# EAGLE design OpenSprinkler_v14 (EAGLE 5.12)
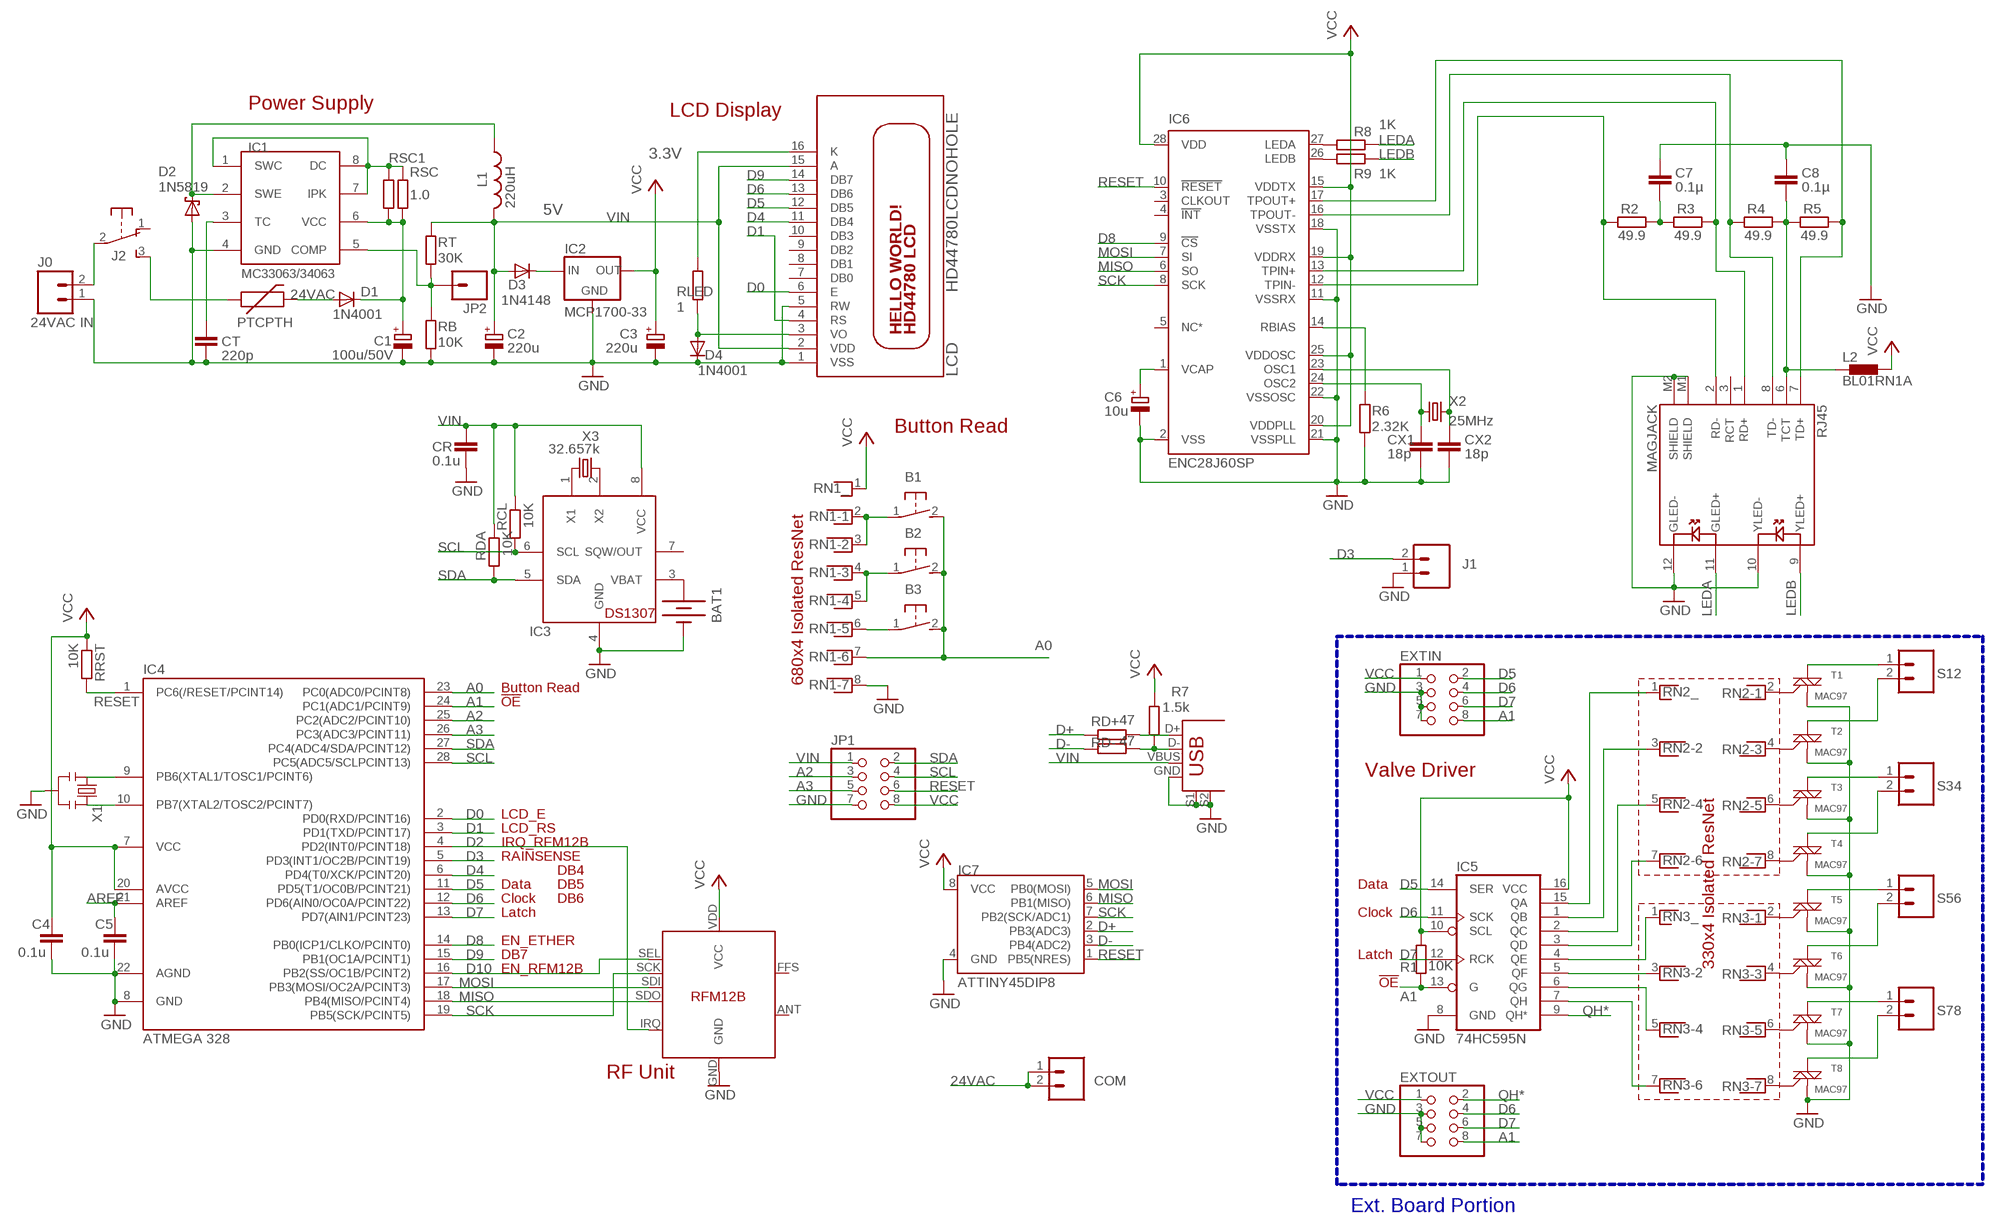
[diagram p0: schematic, sheet 1]

## Parts
B1  31-XX  [B3F-31XX]
B2  31-XX  [B3F-31XX]
B3  31-XX  [B3F-31XX]
BAT1  BATTERY12PTH  [BATTCON_12MM_PTH]
C1  100u/50V  CPOL-EUE3.5-8  [E3,5-8]
C2  220u  CPOL-EUE2-5  [E2-5]
C3  220u  CPOL-EUE2-5  [E2-5]
C4  0.1u  C-EU025-024X044  [C025-024X044]
C5  0.1u  C-EU025-024X044  [C025-024X044]
C6  10u  CPOL-EUE1.8-4  [E1,8-4]
C7  0.1µ  C-EU025-024X044  [C025-024X044]
C8  0.1µ  C-EU025-024X044  [C025-024X044]
COM  M025MM  [SCREWTERMINAL-5MM-2]
CR  0.1u  C-EU025-024X044  [C025-024X044]
CT  220p  C-EU025-024X044  [C025-024X044]
CX1  18p  C-EU025-024X044  [C025-024X044]
CX2  18p  C-EU025-024X044  [C025-024X044]
D1  1N4001  DIODE-DO41-7.6  [DO41-7.6]
D2  1N5819  1N5817-B  [DO41-7.6]
D3  1N4148  1N4148DO35-7  [DO35-7]
D4  1N4001  DIODE-DO41-7.6  [DO41-7.6]
EXTIN  PINHD-2X4  [2X04]
EXTOUT  PINHD-2X4  [2X04]
IC1  MC33063/MC34063P  [DIL08]
IC2  MCP1700-33  MCP1700INLINE  [TO92-INLINE]
IC3  DS1307  [DIL08]
IC4  ATMEGA 328  ATMEGA48/88/168-PU  [DIL28-3]
IC5  74HC595N  74LS595N  [DIL16]
IC6  ENC28J60SP  [DIL28-3]
IC7  ATTINY45DIP8  [DIP08]
IC8  RFM12B  [RFM12B]
J0  24VAC IN  M025MM  [SCREWTERMINAL-5MM-2]
J1  M025MM  [SCREWTERMINAL-5MM-2]
J2  EG1206  [EG1206]
JP1  PINHD-2X4  [2X04]
JP2  M01PTH  [1X01]
L1  220uH  L-US6000-XXX-RC  [6000-XXXX-RC]
L2  BL01RN1A  [BL01RN1A]
LCD  HD44780LCDNOHOLE  [LCD1602A]
PTC  PTCPTH  [PTC]
R1  10K  R-EU_0204/7  [0204/7]
R2  49.9  R-EU_0204/7  [0204/7]
R3  49.9  R-EU_0204/7  [0204/7]
R4  49.9  R-EU_0204/7  [0204/7]
R5  49.9  R-EU_0204/7  [0204/7]
R6  2.32K  R-EU_0204/7  [0204/7]
R7  1.5k  R-EU_0204/7  [0204/7]
R8  1K  R-EU_0204/7  [0204/7]
R9  1K  R-EU_0204/7  [0204/7]
RB  10K  R-EU_0204/7  [0204/7]
RCL  10K  R-EU_0204/7  [0204/7]
RD+  47  R-EU_0204/7  [0204/7]
RD-  47  R-EU_0204/7  [0204/7]
RDA  10K  R-EU_0204/7  [0204/7]
RJ45  MAGJACK  [MAGJACK]
RLED  1  R-EU_0204/7  [0204/7]
RN1  RNX7  [RN-8]
RN2  RNX7  [RN-8]
RN3  RNX7  [RN-8]
RRST  10K  R-EU_0204/7  [0204/7]
RSC  1.0  R-EU_0204/2V  [0204V]
RSC1  1.0  R-EU_0204/2V  [0204V]
RT  30K  R-EU_0204/7  [0204/7]
S12  M025MM  [SCREWTERMINAL-5MM-2]
S34  M025MM  [SCREWTERMINAL-5MM-2]
S56  M025MM  [SCREWTERMINAL-5MM-2]
S78  M025MM  [SCREWTERMINAL-5MM-2]
T1  MAC97  LX807DE  [TO-92]
T2  MAC97  LX807DE  [TO-92]
T3  MAC97  LX807DE  [TO-92]
T4  MAC97  LX807DE  [TO-92]
T5  MAC97  LX807DE  [TO-92]
T6  MAC97  LX807DE  [TO-92]
T7  MAC97  LX807DE  [TO-92]
T8  MAC97  LX807DE  [TO-92]
USB  USB+SHIELD  [USB-B-PTH]
X1  RESONATORPTH  [RESONATOR-PTH]
X2  25MHz  CRYSTALHC49US  [HC49US]
X3  32.657k  CRYSTALTC26H  [TC26H]

## Nets
24VAC [power]: COM.1 COM.2 D1.A PTC.P$2
A0: B1.2(S) B2.2(S) B3.2(S) IC4.23(PC0(ADC0/PCINT8)) RN1.7
A1: EXTIN.8 EXTOUT.8 IC4.24(PC1(ADC1/PCINT9)) IC5.13(G) R1.1
A2: IC4.25(PC2(ADC2/PCINT10)) JP1.3
A3: IC4.26(PC3(ADC3/PCINT11)) JP1.5
AREF: C5.1 IC4.21(AREF)
D0: IC4.2(PD0(RXD/PCINT16)) LCD.6(E)
D1: IC4.3(PD1(TXD/PCINT17)) LCD.4(RS)
D2: IC4.4(PD2(INT0/PCINT18)) IC8.IRQ
D3: IC4.5(PD3(INT1/OC2B/PCINT19)) J1.2
D4: IC4.6(PD4(T0/XCK/PCINT20)) LCD.11(DB4)
D5: EXTIN.2 IC4.11(PD5(T1/OC0B/PCINT21)) IC5.14(SER) LCD.12(DB5)
D6: EXTIN.4 EXTOUT.4 IC4.12(PD6(AIN0/OC0A/PCINT22)) IC5.11(SCK) LCD.13(DB6)
D7: EXTIN.6 EXTOUT.6 IC4.13(PD7(AIN1/PCINT23)) IC5.12(RCK)
D8: IC4.14(PB0(ICP1/CLKO/PCINT0)) IC6.9(!CS)
D9: IC4.15(PB1(OC1A/PCINT1)) LCD.14(DB7)
D10: IC4.16(PB2(SS/OC1B/PCINT2)) IC8.SEL
D+: IC7.2(PB3(ADC3)) RD+.1
D-: IC7.3(PB4(ADC2)) RD-.1
GND [power]: BAT1.GND(-) C1.- C2.- C3.- C4.2 C5.2 C6.- C7.1 C8.1 CR.2 CT.2 CX1.2 CX2.2 D2.A D4.C EXTIN.3 EXTIN.5 EXTIN.7 EXTOUT.3 EXTOUT.5 EXTOUT.7 IC1.4(GND) IC2.1(GND) IC3.4(GND) IC4.8(GND) IC4.22(AGND) IC5.8(GND) IC6.2(VSS) IC6.11(VSSRX) IC6.18(VSSTX) IC6.21(VSSPLL) IC6.22(VSSOSC) IC7.4(GND) IC8.GND J0.1 J1.1 JP1.7 LCD.1(VSS) LCD.5(RW) R6.2 RB.2 RJ45.10(YLED-) RJ45.12(GLED-) RJ45.M1(SHIELD) RJ45.M2(SHIELD) RN1.8 T1.1(M1) T2.1(M1) T3.1(M1) T4.1(M1) T5.1(M1) T6.1(M1) T7.1(M1) T8.1(M1) USB.GND USB.S1 USB.S2 X1.2
LEDA: R8.2 RJ45.11(GLED+)
LEDB: R9.2 RJ45.9(YLED+)
MISO: IC4.18(PB4(MISO/PCINT4)) IC6.6(SO) IC7.6(PB1(MISO)) IC8.SDO
MOSI: IC4.17(PB3(MOSI/OC2A/PCINT3)) IC6.7(SI) IC7.5(PB0(MOSI)) IC8.SDI
N$2: IC4.9(PB6(XTAL1/TOSC1/PCINT6)) X1.1
N$3: RN2.2 T1.2(G)
N$4: IC5.5(QF) RN3.3
N$5: IC5.6(QG) RN3.5
N$6 [power]: J0.2 J2.2(P)
N$7: IC5.7(QH) RN3.7
N$8: IC4.10(PB7(XTAL2/TOSC2/PCINT7)) X1.3
N$9 [power]: C1.+ D1.C IC1.6(VCC) RSC1.2 RSC.2
N$10: IC5.4(QE) RN3.1
N$11: IC5.3(QD) RN2.7
N$12: IC5.2(QC) RN2.5
N$13: IC5.1(QB) RN2.3
N$14: IC5.15(QA) RN2.1
N$15: RN2.4 T2.2(G)
N$16 [power]: S12.1 T1.3(M2)
N$17 [power]: S12.2 T2.3(M2)
N$18 [power]: S34.1 T3.3(M2)
N$19: RN2.6 T3.2(G)
N$20 [power]: S34.2 T4.3(M2)
N$21: RN2.8 T4.2(G)
N$22 [power]: S56.1 T5.3(M2)
N$23 [power]: S56.2 T6.3(M2)
N$24 [power]: S78.1 T7.3(M2)
N$25 [power]: S78.2 T8.3(M2)
N$26: RN3.2 T5.2(G)
N$27: RN3.4 T6.2(G)
N$28: RN3.6 T7.2(G)
N$29: RN3.8 T8.2(G)
N$30: C8.2 L2.1 R4.2 R5.1 RJ45.6(TCT)
N$31 [power]: J2.3(S) PTC.P$1
N$32: B1.1(P) RN1.2 RN1.3
N$33: B3.1(P) RN1.6
N$34: D3.C IC2.2(IN)
N$35: B2.1(P) RN1.4 RN1.5
N$36: BAT1.VCC@1(+) IC3.3(VBAT)
N$37: IC6.27(LEDA) R8.1
N$38: RD+.2 USB.D+
N$39: IC6.26(LEDB) R9.1
N$40 [power]: IC1.1(SWC) IC1.7(IPK) IC1.8(DC) RSC1.1 RSC.1
N$41: IC6.17(TPOUT+) R5.2 RJ45.7(TD+)
N$42: IC6.16(TPOUT-) R4.1 RJ45.8(TD-)
N$43: IC6.13(TPIN+) R3.2 RJ45.1(RD+)
N$44: IC6.12(TPIN-) R2.1 RJ45.2(RD-)
N$45: R7.1 RD-.2 USB.D-
N$46 [power]: D2.C IC1.2(SWE) L1.1
N$47: IC3.2(X2) X3.2
N$48: D4.A LCD.3(VO) RLED.2
N$49: CT.1 IC1.3(TC)
N$50: C6.+ IC6.1(VCAP)
N$51: IC6.14(RBIAS) R6.1
N$52: CX1.1 IC6.24(OSC2) X2.1
N$53: CX2.1 IC6.23(OSC1) X2.2
N$54: C7.2 R2.2 R3.1
N$55: IC1.5(COMP) JP2.1 RB.1 RT.2
N$56: LCD.16(K) RLED.1
N$57: IC3.1(X1) X3.1
QH*: EXTOUT.2 IC5.9(QH*)
RESET: IC4.1(PC6(/RESET/PCINT14)) IC6.10(!RESET) IC7.1(PB5(NRES)) JP1.6 RRST.2
SCK: IC4.19(PB5(SCK/PCINT5)) IC6.8(SCK) IC7.7(PB2(SCK/ADC1)) IC8.SCK
SCL: IC3.6(SCL) IC4.28(PC5(ADC5/SCLPCINT13)) JP1.4 RCL.2
SDA: IC3.5(SDA) IC4.27(PC4(ADC4/SDA/PCINT12)) JP1.2 RDA.2
VCC: C3.+ C4.1 EXTIN.1 EXTOUT.1 IC2.3(OUT) IC4.7(VCC) IC4.20(AVCC) IC5.10(SCL) IC5.16(VCC) IC6.15(VDDTX) IC6.19(VDDRX) IC6.20(VDDPLL) IC6.25(VDDOSC) IC6.28(VDD) IC7.8(VCC) IC8.VDD(VCC) JP1.8 L2.2 R1.2 R7.2 RN1.1 RRST.1
VIN: C2.+ CR.1 D3.A IC3.8(VCC) JP1.1 L1.2 LCD.2(VDD) LCD.15(A) RCL.1 RDA.1 RT.1 USB.VBUS
Unconnected: IC3.7(SQW/OUT) IC6.3(CLKOUT) IC6.4(!INT) IC6.5(NC*) IC8.ANT IC8.FFS J2.1(O) LCD.7(DB0) LCD.8(DB1) LCD.9(DB2) LCD.10(DB3) RJ45.3(RCT)

## Buses
B$1

## Notes on the sheet
- Power Supply
- LCD Display
- 3.3V
- 5V
- Button Read
- 680x4 Isolated ResNet
- Button Read
- !OE
- Valve Driver
- 330x4 Isolated ResNet
- LCD_E
- LCD_RS
- IRQ_RFM12B
- RAINSENSE
- DB4
- Data | DB5 | Data
- Clock | DB6
- Latch | Clock
- EN_ETHER
- DB7 | Latch
- EN_RFM12B
- !OE
- RF Unit
- Ext. Board Portion

## Library data of the parts
B1-B3 = adafruit:31-XX: OMRON SWITCH Now with beefier pads!
BAT1 = SparkFun:BATTERY: Battery Holders Various common sizes : AA, AAA, 20mm coin cell and 12mm coin cell.
C1-C3 C6 = resistor:CPOL-EU: POLARIZED CAPACITOR, European symbol
C4 C5 CR CT = rcl:C-EU: CAPACITOR, European symbol
C7 C8 CX1 CX2 = resistor:C-EU: CAPACITOR, European symbol
COM J0 J1 S12 S34 S56 S78 = SparkFun:M02: Header 2 Standard 2-pin 0.1" header. Use with straight break away headers (SKU : PRT-00116), right angle break away headers (PRT-00553), swiss pins (PRT-00743), machine pins (PRT-00117), and female headers (PRT-00115). Molex polarized connector foot print use with SKU : PRT-08233 with associated crimp pins and housings.
D1 D4 = diode:DIODE-: DIODE
D2 = diode:1N581*: 1.0A SCHOTTKY BARRIER RECTIFIER Source: http://www.diodes.com/datasheets/ds23001.pdf
D3 = diode:1N4148: DIODE high speed (Philips)
EXTIN EXTOUT JP1 = pinhead:PINHD-2X4: PIN HEADER
IC1 = adafruit:MC33063/MC34063: MC33063 and MC34063 Basic DC/DC converter with internal power-NPN transistor, 100KHz, 1.5A peak switch current. 3-40 input/output.
IC2 = adafruit:MCP1700: VOLTAGE REGULATOR
IC3 = adafruit:DS1307: DS1307 Real time clock (RTC) with battery backup ability. Talk to it via i2c
IC4 = atmega8:ATMEGA48/88/168-PU
IC5 = SparkFun:74*595: 8-bit SHIFT REGISTER, output latch
IC6 = microchip:ENC28J60: Stand-Alone Ethernet Controller with SPI Interface Source: http://ww1.microchip.com/downloads/en/DeviceDoc/39662c.pdf; MF: MICROCHIP; MPN: ENC28J60/SP; OC_FARNELL: 1084619; OC_NEWARK: 96K3661
IC7 = SparkFun:ATTINY45: Atmel ATTiny45
IC8 = JeeLabs:RFM12B
J2 = adafruit:EG1206
JP2 = SparkFun:M01: Header 1 Standard 1-pin 0.1" header. Use with straight break away headers (SKU : PRT-00116), right angle break away headers (PRT-00553), swiss pins (PRT-00743), machine pins (PRT-00117), and female headers (PRT-00115).
L1 = rcl:L-US: INDUCTOR, American symbol
L2 = inductors:BL0: Noise Suppression Products/EMI Suppression Filters, Lead EMIFIL(R) Inductor Type Source: http://www.murata.com .. BL01RN1_DS.pdf
LCD = adafruit:HD44780LCD: HD44780 LCD Standard character type LCDs, available in sizes from 8x1 to 40x4!
PTC = SparkFunNew:PTC: Resettable Fuse PTC Resettable Fuse. Spark Fun Electronics SKU : COM-08357
R1-R9 RB RCL RD+ RD- RDA RLED RRST RSC RSC1 RT = rcl:R-EU_: RESISTOR, European symbol
RJ45 = SparkFunNew:MAGJACK
RN1-RN3 = resistor-net:RNX7: RESISTOR NETWORK; OC_FARNELL: unknown; OC_NEWARK: unknown
T1-T8 = SparkFun:LX807DE: LX807DE Triac http://www.littelfuse.com/data/en/Data_Sheets/Littelfuse_Triac_LX8.pdf
USB = SparkFunNew:USB+SHIELD: USB+Shield USB connector with shield pins connectable
X1 = SparkFun:RESONATOR: Resonator Small SMD resonator. This is the itty bitty 10/20MHz resonators with built in caps. CSTCE10M0G55 and CSTCE20M0V53. Footprint has been reviewed closely but hasn't been tested yet.
X2 = SparkFun:CRYSTAL: Crystals Various standard crystals. Proven footprints. Spark Fun Electronics SKU : COM-00534
X3 = crystal:CRYSTAL: CRYSTAL; OC_FARNELL: unknown; OC_NEWARK: unknown

## Net classes
0 default: width 0.305 mm, clearance 0.203 mm
1 power: width 0.813 mm, clearance 0.203 mm

## Board
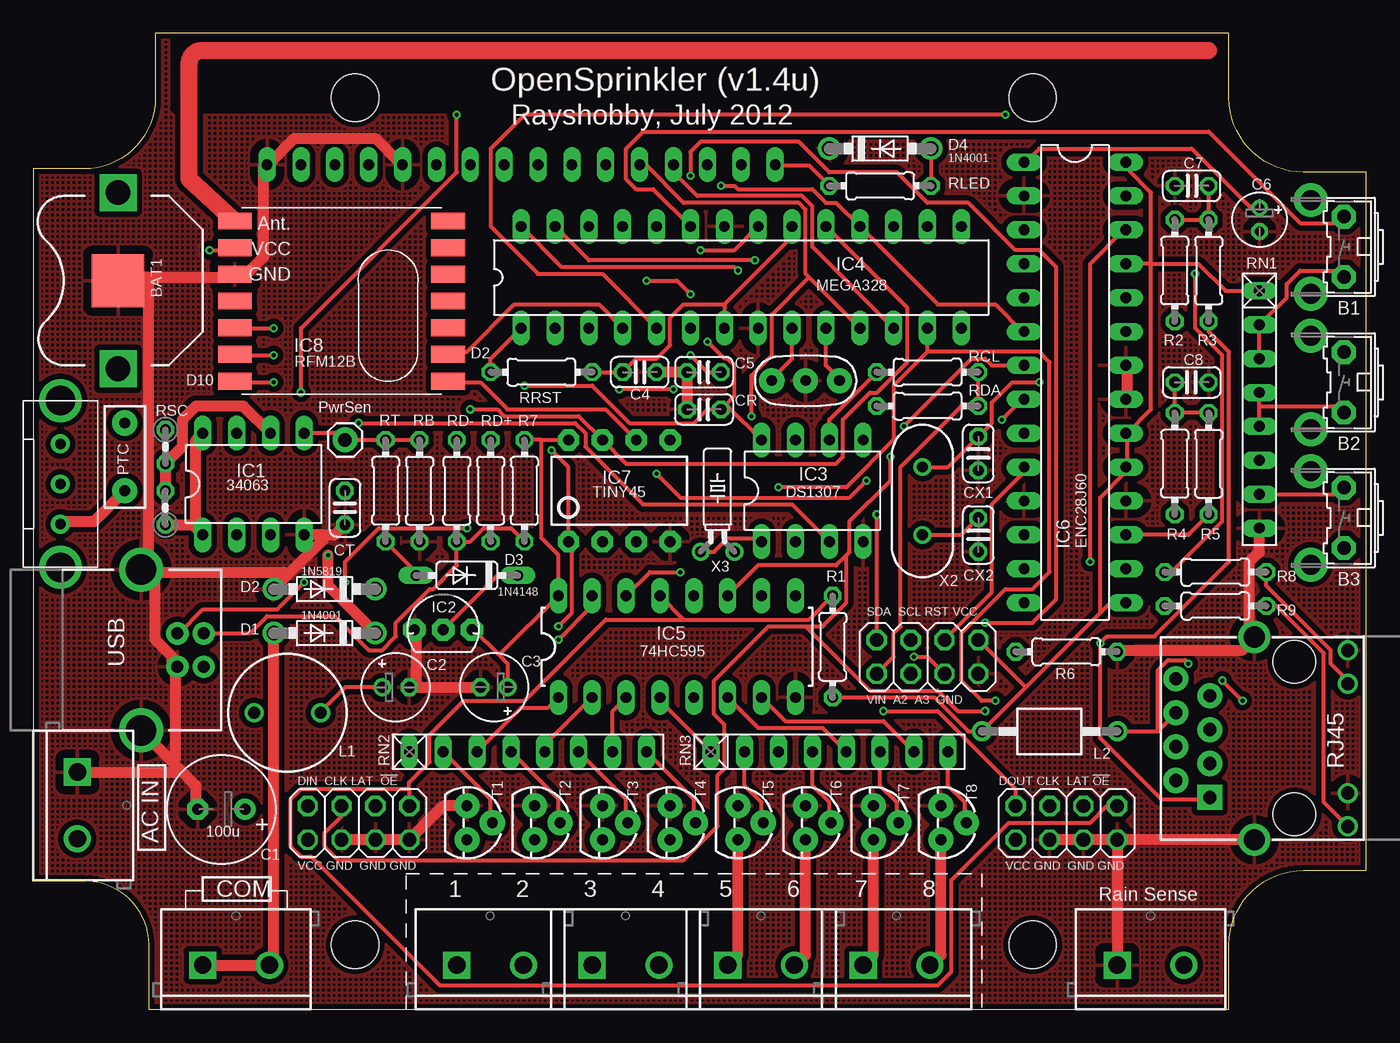
[diagram p1: board, top side]
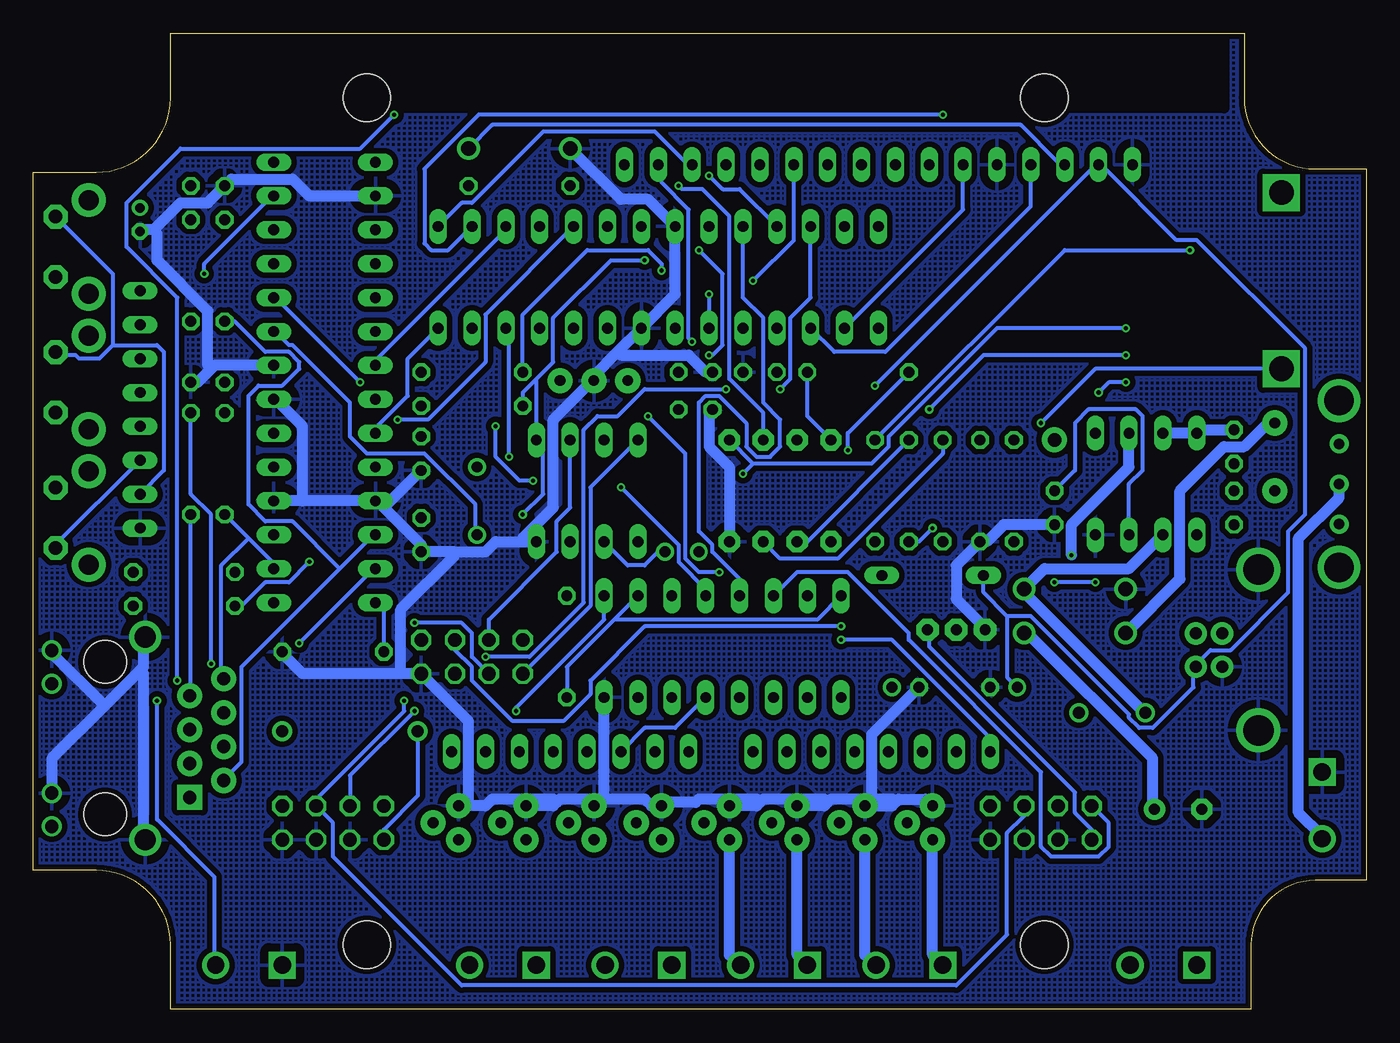
[diagram p2: board, bottom side, seen from below]

Size 99.95 x 73.15 mm. Coordinates in mm from the lower left corner, seen from the top.
Outline: 8.64,0 89.66,0 89.66,4.83 arc-90 95.25,10.41 99.95,10.41 99.95,62.74 95.25,62.74 arc-90 89.66,68.33 89.66,73.15 9.14,73.15 9.14,68.33 arc-90 3.81,62.99 0,62.99 0,9.65 3.81,9.65 arc-90 8.64,4.83 8.64,0
Copper layers (1*16): Top 0.035mm / dielectric 1.5mm / Bottom 0.035mm
Design rules "Fusion_eagle_rule_v1.1 *": minimum track width 6mil, minimum drill 12mil, track to track 6mil, track to pad 6mil, pad to pad 8mil, via to via 8mil, smd to smd 0mil, copper to edge 10mil, drill to drill 10mil, minimum pad ring 10mil, minimum via ring 6mil, stop-mask expansion 2mil, vias tented up to drill 100mil, thermal gap 25mil
Holes 3.56 mm at 24.13,4.83 74.93,4.83 24.13,68.33 74.93,68.33
tRestrict: area 10.7,67.6 to 89.2,72.6
bRestrict: area 10.7,67.6 to 89.2,72.6
vRestrict: area 21.6,2.3 to 26.7,7.4; area 72.4,2.3 to 77.5,7.4; area 64.8,33 to 68.6,43.2; area 25.9,43.7 to 29.7,44.5; area 31,43.7 to 37.6,44.5; area 72.9,10.4 to 82.3,10.9; area 72.4,16.8 to 81.8,17.3; area 19.8,16.8 to 29,17.3; area 19.8,10.4 to 29,10.9; area 35.3,22.1 to 35.8,22.6; area 25.9,25.7 to 26.4,26.2; area 16.8,13.5 to 17.5,14.2; 5 more areas

### Footprints (pad centres in the part's own frame; a part is rotated, then mirrored left to right if it is on the bottom)
B3F-31XX = drill 1.016 pad 1.778 octagon: 1 -2.261,-1.245; 2 2.261,-1.245 | drill 1.499 pad 2.54 round: 3 -3.505,1.245; 4 3.505,1.245
BATTCON_12MM_PTH = smd 3.962 x 3.962: GND 0,0 | drill 1.854 square: VCC@1 -6.604,0; VCC@2 6.604,0
E3,5-8 = drill 0.813 pad 1.6 round: + -1.778,0 | drill 0.813 pad 1.6 octagon: - 1.778,0
E2-5 = drill 0.813 pad 1.27 round: + -1.016,0 | drill 0.813 pad 1.27 octagon: - 1.016,0
C025-024X044 = drill 0.813 octagon: 1 -1.27,0; 2 1.27,0
E1,8-4 = drill 0.711 pad 1.168 round: + -0.889,0 | drill 0.711 pad 1.168 octagon: - 0.889,0
SCREWTERMINAL-5MM-2 = drill 1.3 pad 2.032 square: 1 0,0 | drill 1.3 pad 2.032 round: 2 5,0
DO41-7.6 = drill 1.1 pad 1.7 round: A 3.81,0; C -3.81,0
DO35-7 = drill 0.813 long: A 3.81,0; C -3.81,0
2X04 = drill 1.016 octagon: 1 -3.81,-1.27; 2 -3.81,1.27; 3 -1.27,-1.27; 4 -1.27,1.27; 5 1.27,-1.27; 6 1.27,1.27; 7 3.81,-1.27; 8 3.81,1.27
DIL08 = drill 0.813 long: 1 -3.81,-3.81; 2 -1.27,-3.81; 3 1.27,-3.81; 4 3.81,-3.81; 5 3.81,3.81; 6 1.27,3.81; 7 -1.27,3.81; 8 -3.81,3.81
TO92-INLINE = drill 0.813 pad 1.676 octagon: 1 -2.159,0; 2 0,0; 3 2.159,0
DIL28-3 = drill 0.813 long: 1 -16.51,-3.81; 2 -13.97,-3.81; 3 -11.43,-3.81; 4 -8.89,-3.81; 5 -6.35,-3.81; 6 -3.81,-3.81; 7 -1.27,-3.81; 8 1.27,-3.81; 9 3.81,-3.81; 10 6.35,-3.81; 11 8.89,-3.81; 12 11.43,-3.81; 13 13.97,-3.81; 14 16.51,-3.81; 15 16.51,3.81; 16 13.97,3.81; 17 11.43,3.81; 18 8.89,3.81; 19 6.35,3.81; 20 3.81,3.81; 21 1.27,3.81; 22 -1.27,3.81; 23 -3.81,3.81; 24 -6.35,3.81; 25 -8.89,3.81; 26 -11.43,3.81; 27 -13.97,3.81; 28 -16.51,3.81
DIL16 = drill 0.813 long: 1 -8.89,-3.81; 2 -6.35,-3.81; 3 -3.81,-3.81; 4 -1.27,-3.81; 5 1.27,-3.81; 6 3.81,-3.81; 7 6.35,-3.81; 8 8.89,-3.81; 9 8.89,3.81; 10 6.35,3.81; 11 3.81,3.81; 12 1.27,3.81; 13 -1.27,3.81; 14 -3.81,3.81; 15 -6.35,3.81; 16 -8.89,3.81
DIP08 = drill 0.813 pad 1.6 octagon: 1 -3.81,-3.81; 2 -1.27,-3.81; 3 1.27,-3.81; 4 3.81,-3.81; 5 3.81,3.81; 6 1.27,3.81; 7 -1.27,3.81; 8 -3.81,3.81
RFM12B = smd 2.54 x 1.27: ANT 8,-6; FFS -8,2; GND 8,-2; IRQ -8,4; P$8 -8,0; P$9 -8,-2; P$10 -8,-4; P$12 -8,-6; P$16 8,0; SCK 8,4; SDI 8,2; SDO -8,6; SEL 8,6; VDD 8,-4
EG1206 = drill 0.8 pad 1.422 round: 1 -3,0; 2 0,0; 3 3,0 | drill 2.2 round: MT1 -6.25,0; MT2 6.25,0
1X01 = drill 1.016 pad 1.88 round: 1 0,0
6000-XXXX-RC = drill 0.9 pad 1.422 round: 1 -2.5,0; 2 2.5,0
BL01RN1A = drill 0.9 pad 1.5 round: 1 -5.08,0; 2 5.08,0
LCD1602A = drill 0.8 long: 1 8,33.46; 2 10.54,33.46; 3 13.08,33.46; 4 15.62,33.46; 5 18.16,33.46; 6 20.7,33.46; 7 23.24,33.46; 8 25.78,33.46; 9 28.32,33.46; 10 30.86,33.46; 11 33.4,33.46; 12 35.94,33.46; 13 38.48,33.46; 14 41.02,33.46; 15 43.56,33.46; 16 46.1,33.46
PTC = drill 0.8 pad 1.88 round: P$1 -2.54,0; P$2 2.54,0
0204/7 = drill 0.813 octagon: 1 -3.81,0; 2 3.81,0
MAGJACK = drill 1 pad 1.88 square: 1 3.175,17.445 | drill 1 pad 1.88 round: 2 4.445,19.985; 3 5.715,17.445; 4 6.985,19.985; 5 8.255,17.445; 6 9.525,19.985; 7 10.795,17.445; 8 12.065,19.985 | drill 1 pad 1.27 round: 9 1,7.1; 10 3.5,7.1; 11 11.7,7.1; 12 14.2,7.1 | drill 1.6 pad 2.184 round: M1 0,14.1; M2 15.2,14.1 | hole 3.2: 1.905,11.095; 13.335,11.095
RN-8 = drill 0.813 long: 1 -8.89,0; 2 -6.35,0; 3 -3.81,0; 4 -1.27,0; 5 1.27,0; 6 3.81,0; 7 6.35,0; 8 8.89,0
0204V = drill 0.813 octagon: 1 -1.27,0; 2 1.27,0
TO-92 = drill 0.813 pad 1.88 round: 1 -1.27,0; 2 0,1.905; 3 1.27,0
USB-B-PTH = drill 0.914 pad 1.676 round: D+ 0,1.25; D- 1.981,1.25; GND 0,-1.25; VBUS 1.981,-1.25 | drill 2.286 round: S1 -2.718,-6.02; S2 -2.718,6.02
RESONATOR-PTH = drill 0.8 pad 1.88 round: 1 -2.54,0; 2 0,0; 3 2.54,0
HC49US = drill 0.813 round: 1 -2.54,0; 2 2.54,0
TC26H = drill 0.813 round: 1 -1.27,0; 2 1.27,0

### Placement (x,y rotation side)
B1  97.03,57.15 90 top
B2  97.03,46.99 90 top
B3  97.03,36.83 90 top
BAT1  6.35,54.61 90 top
C1  14.1,14.99 180 top
C2  27.18,24.13 0 top
C3  34.54,24.13 180 top
C4  45.47,47.75 0 top
C5  50.29,47.75 180 top
C6  91.95,59.18 270 top
C7  86.87,61.72 0 top
C8  86.87,46.99 180 top
COM  12.7,3.3 0 top
CR  50.29,44.96 180 top
CT  23.37,37.59 270 top
CX1  70.87,41.66 270 top
CX2  70.87,35.56 270 top
D1  21.84,28.19 180 top
D2  21.84,31.5 180 top
D3  32.51,32.51 180 top
D4  63.5,64.52 0 top
EXTIN  24.38,13.97 0 top
EXTOUT  77.47,13.97 0 top
IC1  16.51,39.37 0 top
IC2  30.73,28.45 0 top
IC3  58.42,38.86 0 top
IC4  53.09,54.86 0 top
IC5  48.26,27.18 0 top
IC6  78.11,46.99 270 top
IC7  43.94,38.86 0 top
IC8  23.11,53.09 180 top
J0  3.3,17.78 270 top
J1  81.28,3.3 0 top
J2  2.03,39.37 270 top
JP1  67.06,26.42 0 top
JP2  23.37,42.67 0 top
L1  19.05,22.23 0 top
L2  76.2,20.83 180 top
LCD  9.53,29.84 0 top
PTC  6.86,41.4 90 top
R1  59.94,27.18 270 top
R2  85.6,55.37 90 top
R3  88.14,55.37 270 top
R4  85.6,40.89 90 top
R5  88.14,40.89 270 top
R6  77.47,26.8 0 top
R7  36.83,38.86 90 top
R8  88.65,32.77 0 top
R9  88.65,30.23 0 top
RB  28.96,38.86 270 top
RCL  67.06,47.75 180 top
RD+  34.29,38.86 270 top
RD-  31.75,38.86 270 top
RDA  67.06,45.21 180 top
RJ45  105.66,12.7 90 top
RLED  63.5,61.72 0 top
RN1  91.95,44.96 270 top
RN2  37.08,19.3 0 top
RN3  59.69,19.3 0 top
RRST  38.1,47.75 180 top
RSC  9.91,42.16 270 top
RSC1  9.91,37.59 90 top
RT  26.42,38.86 90 top
S12  31.75,3.3 0 top
S34  41.91,3.3 0 top
S56  52.07,3.3 0 top
S78  62.23,3.3 0 top
T1  32.51,13.97 270 top
T2  37.59,13.97 270 top
T3  42.67,13.97 270 top
T4  47.75,13.97 270 top
T5  52.83,13.97 270 top
T6  57.91,13.97 270 top
T7  62.99,13.97 270 top
T8  68.07,13.97 270 top
USB  10.79,26.92 0 top
X1  57.91,47.12 0 top
X2  66.67,38.1 270 top
X3  51.31,34.29 0 top

### Tracks (layer width: path | path; a pad name or v marks a point on that pad's centre or on a via)
24VAC
  Top 0.813: D1.A 18.03,3.56 17.78,3.3 COM.2 COM.1
  Bottom 0.813: PTC.P$2 7.37,43.94 9.14,42.16 10.67,42.16 13.97,38.86 13.97,32.26 D1.A
A0
  Top 0.305: RN1.7 97.79,38.61 B3.2 | IC4.23 46.48,61.47 45.21,61.47 44.45,62.23 44.45,64.52 45.72,65.79 88.14,65.79 95,58.93 97.79,58.93 B1.2
  Bottom 0.305: 93.98,49.78 95,48.77 96.52,48.77 96.77,49.02 98.04,49.02 B2.2 | 93.98,49.78 93.98,55.12 B1.2 | RN1.7 90.17,40.39 90.17,49.28 90.68,49.78 93.98,49.78
A1
  Top 0.305: 48.77,29.21 IC5.13 | 48.77,29.21 58.17,29.21 R1.1 | 28.19,16.51 28.19,17.02 29.72,18.54 29.72,20.57 32.26,23.11 36.83,23.11 42.93,29.21 48.77,29.21 | 28.19,16.51 EXTIN.8 | EXTOUT.8 80.52,15.24 79.25,13.97 73.15,13.97 68.83,9.65 68.83,2.79 67.82,1.78 30.48,1.78 20.83,11.43 20.07,11.43 19.3,12.19 19.3,15.75 20.07,16.51 28.19,16.51
  Bottom 0.305: IC4.24 46.74,53.34 45.21,51.82 45.21,45.47 43.94,44.2 43.94,42.16 44.7,41.4 45.72,41.4 46.48,42.16 46.48,43.94 48.51,45.97 49.53,45.97 50.04,45.47 50.04,35.81 49.02,34.8 49.02,34.29 46.99,32.26 IC5.13
A2  (via drill 0.3)
  Top 0.305: v49.28,62.48 49.28,64.26 50.04,65.02 57.4,65.02 59.69,62.74 64.77,62.74 67.06,60.45 70.1,60.45 73.66,56.9 75.44,56.9 76.71,55.63 76.71,30.73 74.93,28.96 v71.37,28.96
  Bottom 0.305: IC4.25 46.99,61.47 48.26,61.47 v49.28,62.48 | v71.37,28.96 67.82,28.96 67.06,28.19 67.06,26.42 JP1.3
A3  (via drill 0.3)
  Top 0.305: v48.01,46.48 v43.94,46.48 | v66.04,26.42 67.06,26.42 JP1.5
  Bottom 0.305: IC4.26 41.66,53.34 43.18,51.82 43.18,47.24 v43.94,46.48 | v48.01,46.48 54.1,46.48 56.13,44.45 57.66,44.45 58.67,43.43 58.67,30.48 62.74,26.42 v66.04,26.42
AREF  (via drill 0.3)
  Top 0.305: C5.1 50.55,47.75 v49.28,49.02 | v50.04,56.9 52.58,56.9 IC4.21
  Bottom 0.305: v49.28,49.02 49.02,49.02 48.26,49.78 48.26,55.12 v50.04,56.9
D0
  Bottom 0.305: IC4.2 30.23,59.94 30.23,63.25 LCD.6
D1
  Bottom 0.305: IC4.3 39.88,49.28 36.07,49.28 25.15,60.2 25.15,63.25 LCD.4
D2
  Top 0.305: IC4.4 42.42,52.83 36.07,52.83 32.51,49.28 31.24,49.28 IC8.IRQ
D3  (via drill 0.3)
  Top 0.305: IC4.5 42.67,55.12 37.85,55.12 34.29,58.67 34.29,64.52 36.83,67.06 v72.9,67.06 | v90.68,23.11 v89.15,24.64
  Bottom 0.305: v72.9,67.06 75.44,64.52 88.9,64.52 92.96,60.45 92.96,57.15 89.15,53.34 v89.15,24.64 | v90.68,23.11 90.68,14.22 86.36,9.91 86.36,3.3 J1.2
D4  (via drill 0.3)
  Top 0.305: v45.97,54.61 48.26,54.61 v49.28,53.59
  Bottom 0.305: v45.97,54.61 42.93,57.66 42.93,63.25 LCD.11 | v49.28,53.59 IC4.6
D5  (via drill 0.3)
  Top 0.305: 58.17,54.86 IC4.11 | 58.17,54.86 57.91,55.12 57.91,59.94 57.4,60.45 48.77,60.45 45.97,63.25 45.47,63.25 LCD.12 | 58.17,54.86 55.37,52.07 55.37,49.02 53.85,47.5 v53.85,44.45 | v48.51,32.77 46.23,32.77 IC5.14
  Bottom 0.305: IC5.14 42.67,32.77 38.86,32.77 34.29,28.19 34.29,27.69 24.38,17.78 24.38,12.19 23.62,11.43 20.07,11.43 19.3,12.19 19.3,13.97 EXTIN.2 | v53.85,44.45 51.05,41.66 51.05,33.78 50.04,32.77 v48.51,32.77
D6  (via drill 0.3)
  Top 0.305: IC4.12 58.42,57.15 58.42,60.2 57.66,60.96 49.78,60.96 48.01,62.74 48.01,63.25 LCD.13 | IC5.11 54.36,33.27 60.2,33.27 60.96,34.04 | 60.96,34.04 61.21,34.29 61.21,36.58 64.26,39.62 v64.26,41.4 | EXTIN.4 23.11,14.48 21.84,13.21 21.84,12.19 22.86,11.18 48.77,11.18 51.31,13.72 51.31,17.53 51.82,18.03 51.82,21.34 51.05,22.1 51.05,24.64 55.12,28.7 57.91,28.7 | 57.91,28.7 59.18,28.7 60.96,30.48 60.96,34.04 | v71.37,22.35 69.34,22.35 67.82,23.88 62.74,23.88 57.91,28.7
  Bottom 0.305: v64.26,41.4 64.26,50.8 IC4.12 | EXTOUT.4 76.2,17.53 v71.37,22.35
D7  (via drill 0.3)
  Top 0.305: v55.88,39.12 60.96,39.12 64.52,42.67 64.52,46.74 67.06,49.28 | 67.06,49.28 IC4.13 | 67.06,49.28 75.44,49.28 76.2,48.51 76.2,32.77 74.93,31.5 72.9,31.5 69.6,28.19 69.6,24.64 71.12,23.11 v72.14,23.11
  Bottom 0.305: IC5.12 49.53,31.5 51.56,33.53 51.56,34.8 v55.88,39.12 | EXTIN.6 25.65,14.48 26.92,13.21 26.92,5.59 30.73,1.78 67.82,1.78 77.47,11.43 77.47,13.97 EXTOUT.6 78.74,15.75 72.14,22.35 v72.14,23.11
D8
  Bottom 0.305: IC4.14 71.88,48.77 71.88,45.97 74.17,43.69 74.17,43.18 IC6.9
D9
  Bottom 0.305: IC4.15 67.82,60.45 67.06,60.45 61.72,65.79 53.34,65.79 51.05,63.5 50.55,63.5 LCD.14
D10  (via drill 0.3)
  Top 0.305: v18.03,46.99 15.24,46.99 IC8.SEL | v20.07,46.23 20.07,51.05 31.75,62.74 v31.75,67.06
  Bottom 0.305: v18.03,46.99 19.3,46.99 v20.07,46.23 | v31.75,67.06 66.55,67.06 70.61,62.99 70.61,57.4 70.1,56.9 68.83,56.9 IC4.16
D+
  Bottom 0.305: RD+.1 41.91,35.05 IC7.2
D-
  Bottom 0.305: RD-.1 31.75,41.66 39.62,33.78 43.94,33.78 IC7.3
GND
  Top 0.813: 8.64,54.86 6.6,54.86 BAT1.GND | 8.64,54.86 14.99,54.86 IC8.GND 15.49,55.12 16,55.12 17.27,56.39 17.27,63.25 LCD.1 17.78,63.5 19.56,65.28 25.65,65.28 27.43,63.5 LCD.5 | 10.41,18.54 8.13,20.83 USB.S1 | 10.92,18.03 10.41,18.54 | 10.92,18.03 12.19,16.76 12.19,14.99 C1.- | 10.41,18.54 10.67,18.8 10.67,25.65 USB.GND 10.41,25.91 10.41,26.42 9.14,27.69 9.14,32.51 USB.S2 | J0.1 10.67,17.78 10.92,18.03 | 21.84,35.56 22.61,35.56 CT.2 | 21.84,35.56 IC1.4 | 19.05,32.51 21.84,35.31 21.84,35.56 | 19.05,32.51 D2.A | USB.S2 8.13,32.77 18.8,32.77 19.05,32.51 | 8.64,54.86 8.64,33.02 USB.S2 | C3.- C2.- 28.7,24.38 28.7,28.45 IC2.1 | EXTIN.3 EXTIN.5 EXTIN.7 30.73,15.24 T1.1 | EXTOUT.3 EXTOUT.5 EXTOUT.7 | EXTOUT.7 J1.1 | RJ45.M1 EXTOUT.7 | R6.2 81.28,26.92 90.68,26.92 91.44,27.69 RJ45.M2 91.19,27.94 91.19,33.53 91.95,34.29 RN1.8 | CR.2 C5.2 C4.2 | IC6.21 82.04,45.72 82.04,48.26 IC6.22
  Bottom 0.813: CT.2 27.18,36.32 28.45,35.05 RB.2 30.73,33.27 30.73,30.73 28.45,28.45 IC2.1 | 57.15,16 IC5.8 | 57.15,16 T6.1 57.91,15.75 60.45,15.75 60.71,15.49 | 57.15,16 56.9,15.75 54.1,15.75 53.59,15.24 T5.1 52.58,15.49 50.29,15.49 50.04,15.75 45.72,15.75 45.47,15.49 | T7.1 60.96,15.24 60.71,15.49 | 60.71,15.49 60.96,15.75 65.53,15.75 66.04,15.24 T8.1 67.31,15.49 67.31,21.59 JP1.7 72.39,25.15 | 35.31,15.49 35.05,15.75 33.02,15.75 T1.1 | 35.31,15.49 35.56,15.24 T2.1 37.08,16 37.08,20.57 C3.- | T3.1 40.64,15.24 40.39,15.49 | 40.39,15.49 40.13,15.75 35.56,15.75 35.31,15.49 | T4.1 45.72,15.24 45.47,15.49 | 45.47,15.49 45.21,15.75 40.64,15.75 40.39,15.49 | 91.95,25.4 91.69,25.65 91.69,27.69 RJ45.M2 | 91.95,25.4 94.61,22.73 | 94.61,22.73 98.55,18.8 98.55,16.26 RJ45.10 | RJ45.12 98.55,26.67 94.61,22.73 | 72.39,25.15 79.76,25.15 81.28,26.67 R6.2 | RJ45.M1 91.69,12.7 91.69,25.15 91.95,25.4 | IC7.4 47.75,40.64 49.28,42.16 49.28,44.7 CR.2 | 56.13,49.28 57.91,47.5 X1.2 58.17,46.99 60.96,44.2 60.96,37.59 63.25,35.31 63.25,35.05 | 56.13,49.28 IC4.8 51.82,53.59 IC4.22 53.85,60.71 55.88,60.71 D4.C | C5.2 49.53,47.75 50.8,49.02 55.88,49.02 56.13,49.28 | 90.93,58.42 91.95,58.42 C6.- | 90.93,58.42 88.9,60.45 86.87,60.45 C7.1 85.09,62.23 80.52,62.23 79.25,60.96 IC6.2 | C8.1 87.63,46.99 86.61,48.01 | 86.61,48.01 86.36,48.26 IC6.22 | IC6.11 74.17,38.1 70.87,34.8 CX2.2 68.33,34.29 | 63.25,35.05 65.28,35.05 66.04,34.29 68.33,34.29 | 63.25,35.05 IC3.4 | CX1.2 73.41,37.85 IC6.11 | 79.76,38.1 IC6.18 | IC6.11 79.76,38.1 | IC6.21 81.79,45.72 79.76,43.69 79.76,38.1 | 90.93,58.42 90.68,58.17 90.68,56.13 86.87,52.32 86.87,48.26 86.61,48.01
  Bottom 0.813: 72.39,25.15 72.39,29.97 68.33,34.04 68.33,34.29
  pour Top (isolate 0.406, hatched): 0,73.66 100.33,73.66 100.33,0 0,0
  pour Bottom (isolate 0.406, hatched): 0,73.66 100.33,73.66 100.33,0 0,0
LEDA
  Top 0.305: R8.2 92.46,31.75 97.28,26.92 97.28,25.91 98.55,24.64 RJ45.11
LEDB
  Top 0.305: R9.2 93.22,30.23 96.77,26.67 96.77,15.49 98.55,13.72 RJ45.9
MISO  (via drill 0.3)
  Top 0.305: IC7.6 42.93,44.96 35.56,44.96 33.53,46.99 31.24,46.99 IC8.SDO | IC6.6 74.17,50.8 72.14,52.83 67.82,52.83 IC4.18 60.2,60.45 59.44,60.45 58.42,61.47 52.83,61.47 52.58,61.72 v51.56,61.72
  Bottom 0.305: IC7.6 45.21,44.7 47.75,47.24 47.75,59.44 49.78,61.47 51.31,61.47 v51.56,61.72
MOSI  (via drill 0.3)
  Top 0.305: v18.03,51.05 15.24,51.05 IC8.SDI | v65.28,43.69 70.36,48.77 71.37,48.77 71.88,48.26 IC6.7 | v62.48,39.62 61.21,38.35 48.51,38.35 v46.74,40.13
  Bottom 0.305: IC4.17 64.52,58.42 74.17,48.77 74.17,48.26 IC6.7 | v18.03,51.05 27.69,51.05 35.81,42.93 35.81,42.16 37.08,40.89 45.97,40.89 | 45.97,40.89 IC7.5 | v65.28,43.69 65.28,41.4 63.5,39.62 v62.48,39.62 | 45.97,40.89 v46.74,40.13
N$1
  Top 1.27: 88.14,71.88 12.7,71.88 arc90 11.68,70.87 11.68,62.23 14.99,59.18
N$2
  Top 0.305: IC4.9 56.9,48.77 55.37,47.24 X1.1
N$3
  Top 0.305: RN2.2 34.29,15.75 34.29,13.97 T1.2
N$4
  Bottom 0.305: IC5.5 51.82,21.08 54.1,21.08 RN3.3
N$5
  Top 0.305: IC5.6 54.36,21.08 59.18,21.08 RN3.5
N$6
  Bottom 0.813: J2.2 2.03,38.35 5.08,35.31 5.08,14.73 3.3,12.95 J0.2
N$7
  Top 0.305: IC5.7 56.39,21.59 63.75,21.59 RN3.7
N$8
  Top 0.305: IC4.10 59.44,48.26 60.45,47.24 X1.3
N$9  (via drill 0.3)
  Top 0.813: RSC1.2 RSC.2 11.18,42.16 11.18,44.2 12.19,45.21 15.75,45.21 IC1.6 | v22.1,34.04 22.1,31.75 D1.C
  Bottom 0.813: D1.C 25.4,28.19 16,18.8 16,14.99 C1.+ | IC1.6 17.78,40.64 22.1,36.32 v22.1,34.04
N$10
  Top 0.305: RN3.1 46.99,23.11 IC5.4
N$11
  Top 0.305: RN2.7 43.43,22.35 IC5.3
N$12
  Top 0.305: RN2.5 38.35,19.81 IC5.2
N$13
  Top 0.305: RN2.3 36.58,22.61 38.61,22.61 IC5.1
N$14  (via drill 0.3)
  Top 0.305: v39.37,27.69 41.91,30.23 IC5.15
  Bottom 0.305: RN2.1 28.19,20.32 35.56,27.69 v39.37,27.69
N$15
  Top 0.305: RN2.4 39.37,15.75 39.37,13.97 T2.2
N$16
  Bottom 0.813: T1.3 32.51,4.06 S12.1
N$17
  Bottom 0.813: T2.3 37.59,4.06 36.83,3.3 S12.2
N$18
  Bottom 0.813: T3.3 42.67,4.06 S34.1
N$19
  Top 0.305: RN2.6 44.45,15.75 44.45,13.97 T3.2
N$20
  Bottom 0.813: T4.3 47.75,4.06 46.99,3.3 S34.2
N$21
  Top 0.305: RN2.8 49.53,15.75 49.53,13.97 T4.2
N$22
  Top 0.813: T5.3 52.83,4.06 S56.1
N$23
  Top 0.813: T6.3 57.91,4.06 57.15,3.3 S56.2
N$24
  Top 0.813: T7.3 62.99,4.06 S78.1
N$25
  Top 0.813: T8.3 68.07,4.06 67.31,3.3 S78.2
N$26
  Top 0.305: RN3.2 53.34,16.76 54.61,15.49 54.61,13.97 T5.2
N$27
  Top 0.305: RN3.4 58.42,16.76 59.69,15.49 59.69,13.97 T6.2
N$28
  Top 0.305: RN3.6 63.5,16.76 64.77,15.49 64.77,13.97 T7.2
N$29
  Top 0.305: RN3.8 68.58,16.76 69.85,15.49 69.85,13.97 T8.2
N$30  (via drill 0.3)
  Top 0.305: C8.2 R4.2 R5.1 | L2.1 84.33,20.83 | 84.33,20.83 85.6,22.1 RJ45.6 | v86.61,25.91 86.36,26.16 85.09,26.16 84.33,25.4 84.33,20.83
  Bottom 0.305: R5.1 88.14,38.61 86.61,37.08 v86.61,25.91
N$31
  Top 0.813: PTC.P$1 4.57,36.58 2.03,36.58 J2.3
N$32
  Top 0.305: RN1.3 RN1.2 93.98,53.34 93.98,54.36 95,55.37 97.79,55.37 B1.1
N$33
  Bottom 0.305: RN1.6 98.3,34.8 B3.1
N$34
  Top 0.305: D3.C 34.8,32.51 IC2.2
N$35
  Top 0.305: 91.95,45.21 RN1.4 | RN1.5 91.95,45.21 | 91.95,45.21 97.79,45.21 B2.1
N$36  (via drill 0.3)
  Top 0.305: IC3.3 56.9,37.85 45.72,37.85 41.4,42.16 41.4,43.18 40.64,43.94 v24.38,43.94
  Bottom 0.305: v24.38,43.94 20.32,48.01 BAT1.VCC@1
N$37  (via drill 0.3)
  Top 0.305: R8.1 85.34,32.77 89.15,36.58 89.15,49.02 87.12,51.05 v87.12,55.12
  Bottom 0.305: v87.12,55.12 87.12,55.88 82.04,60.96 IC6.27
N$38  (via drill 0.3)
  Top 0.305: v32.51,36.07 25.91,36.07 23.37,33.53 v23.37,32 | v20.32,32 18.29,29.97 12.7,29.97 10.92,28.19 USB.D+
  Bottom 0.305: RD+.2 33.53,35.05 v32.51,36.07 | v20.32,32 v23.37,32
N$39  (via drill 0.3)
  Top 0.305: v79.25,33.53 79.25,55.88 81.79,58.42 IC6.26
  Bottom 0.305: R9.1 84.33,30.23 82.55,32 80.77,32 v79.25,33.53
N$40
  Top 0.813: RSC1.1 11.94,36.32 IC1.1 12.19,36.58 12.19,42.67 IC1.8
  Bottom 0.813: RSC.1 12.45,43.43 IC1.8 IC1.7
N$41
  Top 0.305: R5.2 86.61,35.56 IC6.17
  Bottom 0.305: R5.2 88.14,23.62 RJ45.7
N$42
  Bottom 0.305: 83.82,35.31 R4.1 | 83.82,35.31 82.04,33.53 82.04,33.02 IC6.16 | 83.82,35.31 85.85,33.27 85.85,24.89 RJ45.8
N$43  (via drill 0.3)
  Top 0.305: RJ45.1 88.14,15.75 84.58,15.75 80.01,20.32 v80.01,27.43 80.52,27.94 84.07,27.94 89.66,33.53 89.66,49.28 88.14,50.8 R3.2
  Bottom 0.305: v80.01,27.43 74.42,33.02 IC6.13
N$44
  Bottom 0.305: 76.96,33.02 84.33,25.65 84.33,18.54 85.6,17.27 RJ45.2 | 76.96,33.02 74.42,35.56 IC6.12 | R2.1 84.84,51.56 82.55,49.28 80.77,49.28 80.01,48.51 80.01,48.01 81.28,46.74 83.06,46.74 83.82,45.97 83.82,37.85 82.55,36.58 80.52,36.58 76.96,33.02
N$45
  Top 0.305: R7.1 35.81,36.07 33.78,36.07 32.77,35.05 RD-.2 31.75,33.27 29.97,31.5 29.72,31.5 27.18,28.96 27.18,27.94 26.16,26.92 25.15,26.92 22.61,29.46 17.53,29.46 16.26,28.19 12.95,28.19 USB.D-
N$46
  Bottom 0.813: IC1.2 17.78,33.02 24.13,33.02 D2.C 25.65,31.24 16.76,22.35 L1.1
N$47
  Bottom 0.305: X3.2 53.09,34.29 54.1,33.27 55.37,33.27 IC3.2
N$48
  Top 0.305: D4.A RLED.2
  Bottom 0.305: D4.A 65.53,66.29 25.91,66.29 23.11,63.5 22.61,63.5 LCD.3
N$49
  Bottom 0.305: IC1.3 17.78,39.37 16.76,40.39 16.76,44.45 17.27,44.96 20.83,44.96 21.84,43.94 21.84,40.39 CT.1
N$50
  Top 0.305: C6.+ 91.95,60.2 91.19,60.2 86.87,64.52 75.44,64.52 74.42,63.5 IC6.1
N$51
  Bottom 0.305: R6.1 73.66,29.97 74.17,30.48 IC6.14
N$52  (via drill 0.3)
  Top 0.305: X2.1 68.58,40.64 CX1.1 71.88,43.94 71.88,45.47 73.41,46.99 v75.44,46.99
  Bottom 0.305: v75.44,46.99 81.79,53.34 IC6.24
N$53
  Top 0.305: CX2.1 69.6,35.56 X2.2
  Bottom 0.305: IC6.23 81.79,50.8 80.77,49.78 80.52,49.78 76.2,45.47 76.2,42.93 74.93,41.66 70.61,41.66 66.8,37.85 66.8,35.56 X2.2
N$54
  Top 0.305: R2.2 R3.1 C7.2
N$55
  Top 0.305: RB.1 RT.2 JP2.1 22.86,43.18 IC1.5
N$56
  Top 0.305: RLED.1 58.17,63.25 55.63,63.25 LCD.16
N$57
  Top 0.305: X3.1 51.05,34.29 52.07,35.31 54.36,35.31 IC3.1
QH*  (via drill 0.3)
  Top 0.305: v63.75,22.35 67.82,22.35 73.66,16.51 EXTOUT.2
  Bottom 0.305: IC5.9 57.15,29.21 63.75,22.61 v63.75,22.35
RESET  (via drill 0.3)
  Top 0.305: JP1.6 71.88,31.24 71.88,37.85 74.17,40.13 74.17,40.64 IC6.10 | RRST.2 34.29,48.77 IC4.1 | v38.86,41.91 40.13,40.64 IC7.1 40.39,34.8 40.39,29.72 v39.37,28.7
  Bottom 0.305: v38.86,41.91 38.86,43.18 RRST.2 | JP1.6 68.33,26.92 67.06,25.65 67.06,24.64 64.01,21.59 60.2,21.59 58.17,23.62 58.17,24.64 54.1,28.7 v39.37,28.7
SCK  (via drill 0.3)
  Top 0.305: v72.64,44.2 74.17,45.72 IC6.8 | v18.03,49.02 15.24,49.02 IC8.SCK | v32.77,44.96 34.8,44.96 35.31,44.45 40.89,44.45 IC7.7 44.45,40.89 60.2,40.89 60.71,41.4 60.71,44.2 62.74,46.23 63.25,46.23 65.53,48.51 65.53,52.58 IC4.19
  Bottom 0.305: IC4.19 66.04,52.07 66.04,48.51 70.36,44.2 v72.64,44.2 | v18.03,49.02 28.7,49.02 v32.77,44.96
SCL  (via drill 0.3)
  Top 0.305: IC4.28 39.62,55.63 52.58,55.63 v52.83,55.37 | IC3.6 59.69,44.2 RCL.2
  Bottom 0.305: v52.83,55.37 52.83,55.88 53.85,56.9 58.42,56.9 63.25,52.07 RCL.2 | JP1.4 65.79,29.21 60.71,34.29 60.71,36.58 59.69,37.59 IC3.6
SDA  (via drill 0.3)
  Top 0.305: IC4.27 41.66,56.13 v54.1,56.13 | JP1.2 v63.25,37.08
  Bottom 0.305: v54.1,56.13 56.64,56.13 60.96,51.82 60.96,48.51 62.23,47.24 | 62.23,47.24 63.25,46.23 RDA.2 | 62.23,47.24 IC3.5 61.72,42.16 61.72,38.61 v63.25,37.08
VCC  (via drill 0.3)
  Top 0.305: C3.+ 35.56,25.91 34.8,26.67 | 34.8,26.67 33.02,28.45 IC2.3 | 34.8,26.67 35.05,26.67 IC5.16 39.37,34.04 38.1,35.31 38.1,42.67 | 51.82,52.83 IC4.7 | 51.82,52.83 56.9,57.91 IC4.20 | RRST.1 C4.1 45.21,48.77 46.74,48.77 47.75,49.78 47.75,51.82 48.77,52.83 51.82,52.83 | v13.21,56.9 14.99,56.9 IC8.VDD | 38.1,42.67 R7.2 | 38.1,42.67 IC7.8 | RN1.1 89.41,53.85 87.38,55.88 83.82,55.88 | 83.82,55.88 IC6.25 | 83.82,55.88 83.82,61.21 82.04,62.99 82.04,63.5 IC6.28 | 82.04,43.18 82.04,40.64 IC6.19 81.79,40.64 81.79,40.13 80.01,38.35 80.01,29.72 | 74.42,24.13 L2.2 70.1,20.83 67.56,23.37 R1.2 | 74.42,24.13 80.01,29.72 | 80.01,29.72 80.77,30.48 IC6.15 | 74.42,24.13 JP1.8 | 83.82,55.88 83.82,44.96 82.04,43.18 | 82.04,43.18 IC6.20
  Bottom 0.305: EXTIN.1 20.57,13.46 21.84,14.73 21.84,16.26 32.77,27.18 32.77,28.45 IC2.3 | v13.21,56.9 22.61,56.9 R7.2 | RRST.1 41.91,44.45 IC7.8 | R1.2 59.94,25.65 56.39,29.21 | 56.39,29.21 IC5.10 | EXTOUT.1 73.66,13.46 71.12,16 L2.2 | IC5.16 41.15,29.21 56.39,29.21
VIN  (via drill 0.3)
  Top 0.305: RCL.1 RDA.1 69.6,45.21 65.02,40.64 65.02,28.7 64.52,28.19 64.52,26.42 JP1.1 | v50.55,50.04 51.82,48.77 52.07,48.77 52.58,48.26 52.58,45.97 51.82,45.21 | IC3.8 52.07,45.21 51.82,45.21 | 51.82,45.21 CR.1 50.55,44.96 49.53,43.94 44.7,43.94 41.91,46.74 v36.83,46.74 | RT.1 28.7,32.77 D3.A | C2.+ 23.37,24.13 21.59,22.35 L1.2
  Bottom 0.305: v50.55,50.04 50.8,50.29 50.8,59.94 52.83,61.98 52.83,63.25 LCD.15 | JP1.1 58.17,30.23 58.17,39.12 IC3.8 | D3.A 28.7,31.24 26.92,29.46 | 26.92,29.46 26.92,24.89 C2.+ | 26.92,29.46 25.15,29.46 17.78,22.1 17.78,21.84 17.02,21.08 16,21.08 12.95,24.13 12.95,25.65 USB.VBUS 12.7,25.91 11.68,26.92 10.16,26.92 5.84,31.24 5.84,35.81 4.57,37.08 4.57,49.53 12.7,57.66 14.22,57.66 19.81,63.25 LCD.2 20.07,63.5 v36.83,46.74

### Text on the board
tNames: OpenSprinkler (v1.4u) | Rayshobby, July 2012 | 1N4001 | MEGA328 | D2 | RFM12B | D10 | PwrSen | 34063 | TINY45 | DS1307 | ENC28J60 | 1N5819 | 1N4148 | 1N4001 | SDA SCL RST VCC | USB | 74HC595 | VIN A2 A3 GND | RJ45 | DIN CLK LAT !OE | DOUT CLK LAT !OE | 100u | AC IN | VCC GND GND GND | VCC GND GND GND | 1 | 2 | 3 | 4 | 5 | 6 | 7 | 8 | Rain Sense
BoxDim: Serpac WM-032RC Enclosure | All units are in inch | Left | Right | Front | 0.14 | 0.32 | 1.28 | 0.91 | 0.32 | 1.0 | 0.26 | 0.4 | 0.29 | 3.25 | 0.45 | 0.7 | 0.53 | 0.4 | 0.32 | 0.63 | Bottom | 1.28 | 0.32 | 1.6 | 1.6 | 4.38